# EAGLE schematic Analog-Wall-Clock (EAGLE 6.6.0)
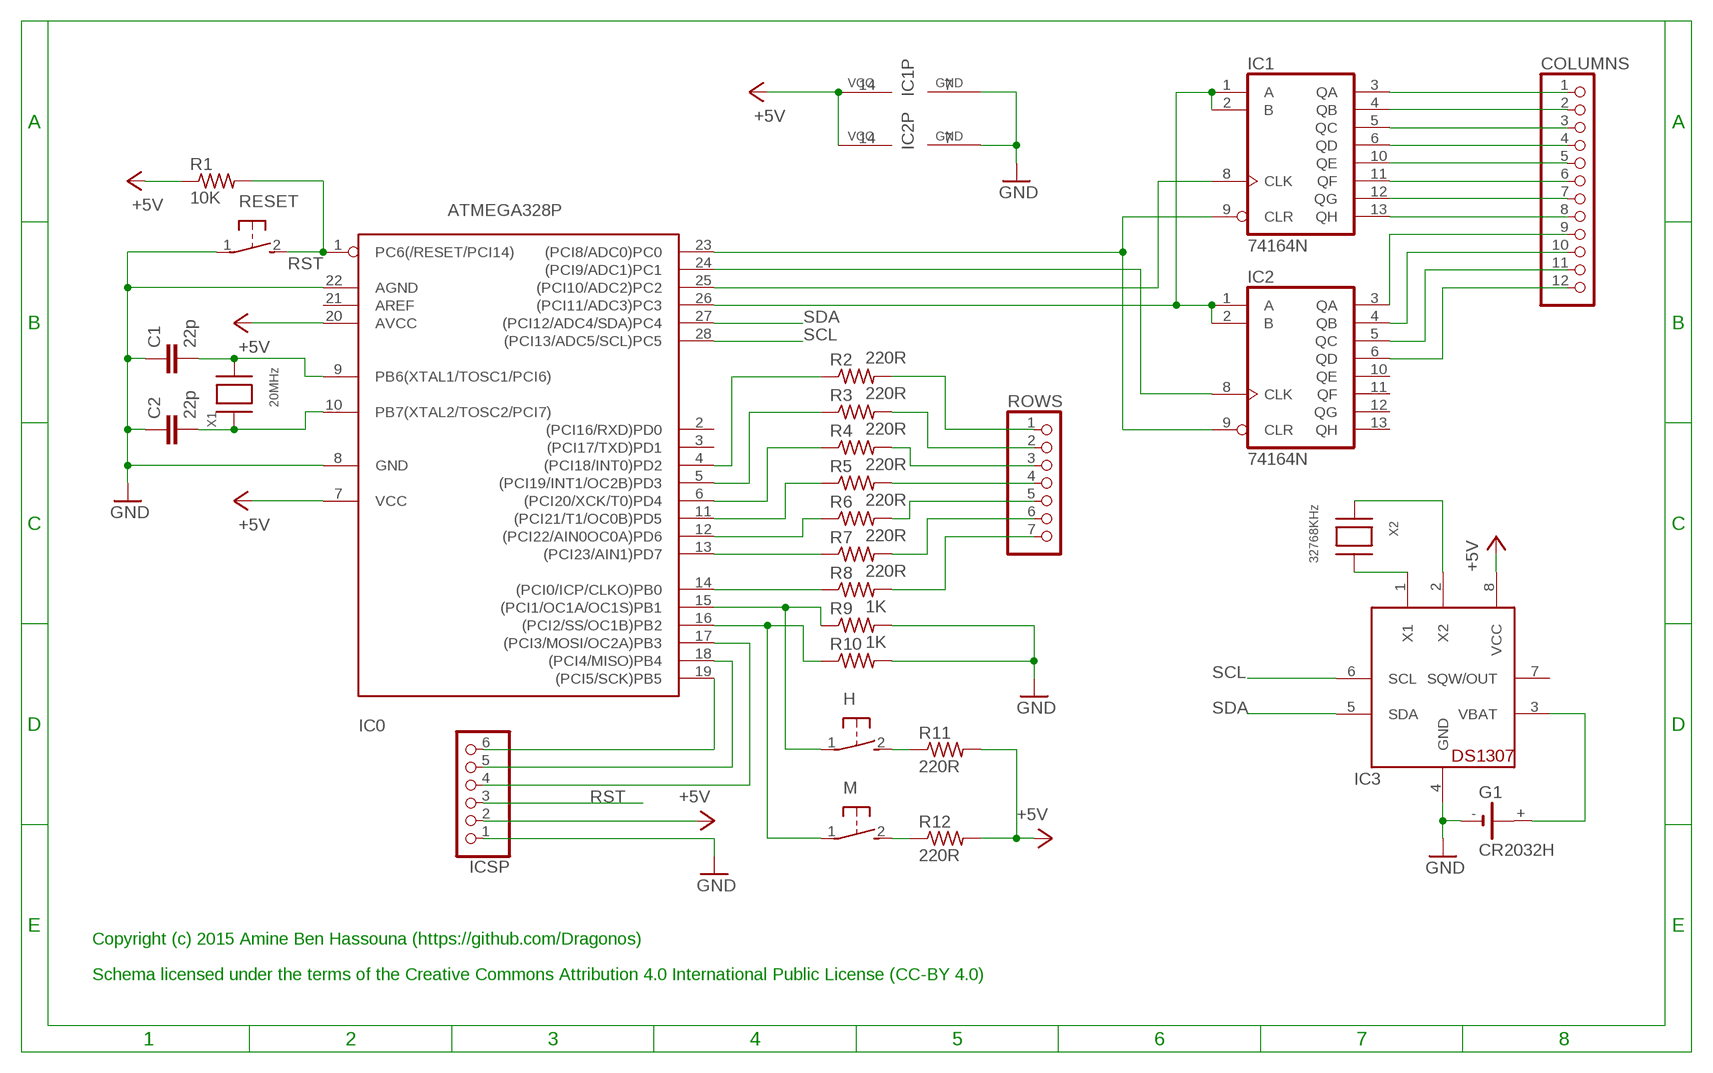
[diagram p0: schematic, sheet 1]

## Parts
C1  22p  C2,5-3  [C2.5-3]
C2  22p  C2,5-3  [C2.5-3]
COLUMNS  PINHD-1X12  [1X12]
G1  CR2032H  [CR2032H]
H  31-XX  [B3F-31XX]
IC0  ATMEGA328P  ATMEGA168-20P  [DIL28-3]
IC1  74164N  [DIL14]
IC2  74164N  [DIL14]
IC3  DS1307  [DIL08]
ICSP  PINHD-1X6  [1X06]
M  31-XX  [B3F-31XX]
R1  10K  R-US_0207/10  [0207/10]
R2  220R  R-US_0207/10  [0207/10]
R3  220R  R-US_0207/10  [0207/10]
R4  220R  R-US_0207/10  [0207/10]
R5  220R  R-US_0207/10  [0207/10]
R6  220R  R-US_0207/10  [0207/10]
R7  220R  R-US_0207/10  [0207/10]
R8  220R  R-US_0207/10  [0207/10]
R9  1K  R-US_0207/10  [0207/10]
R10  1K  R-US_0207/10  [0207/10]
R11  220R  R-US_0207/10  [0207/10]
R12  220R  R-US_0207/10  [0207/10]
RESET  31-XX  [B3F-31XX]
ROWS  PINHD-1X7  [1X07]
X1  20MHz  XTAL-3.2X1.5  [XTAL3215]
X2  32768KHz  XTAL-3.2X1.5  [XTAL3215]

## Nets
+5V: IC0.7(VCC) IC0.20(AVCC) IC1.14(VCC) IC2.14(VCC) IC3.8(VCC) ICSP.2 R1.1 R11.2 R12.2
GND: C1.1 C2.1 G1.- IC0.8(GND) IC0.22(AGND) IC1.7(GND) IC2.7(GND) IC3.4(GND) ICSP.1 R9.2 R10.2 RESET.1(P)
N$1: G1.+ IC3.3(VBAT)
N$2: C1.2 IC0.9(PB6(XTAL1/TOSC1/PCI6)) X1.P$1
N$3: C2.2 IC0.10(PB7(XTAL2/TOSC2/PCI7)) X1.P$2
N$4: IC0.4((PCI18/INT0)PD2) R2.1
N$5: IC0.5((PCI19/INT1/OC2B)PD3) R3.1
N$6: IC0.6((PCI20/XCK/T0)PD4) R4.1
N$7: IC0.11((PCI21/T1/OC0B)PD5) R5.1
N$8: IC0.12((PCI22/AIN0OC0A)PD6) R6.1
N$9: IC0.13((PCI23/AIN1)PD7) R7.1
N$10: IC0.14((PCI0/ICP/CLKO)PB0) R8.1
N$11: R5.2 ROWS.4
N$12: R6.2 ROWS.5
N$13: R7.2 ROWS.6
N$14: R8.2 ROWS.7
N$15: R4.2 ROWS.3
N$16: R3.2 ROWS.2
N$17: R2.2 ROWS.1
N$18: H.1(P) IC0.15((PCI1/OC1A/OC1S)PB1) R9.1
N$19: IC0.16((PCI2/SS/OC1B)PB2) M.1(P) R10.1
N$20: IC0.17((PCI3/MOSI/OC2A)PB3) ICSP.4
N$21: IC0.18((PCI4/MISO)PB4) ICSP.5
N$22: IC3.1(X1) X2.P$1
N$23: IC3.2(X2) X2.P$2
N$24: H.2(S) R11.1
N$25: M.2(S) R12.1
N$26: IC0.26((PCI11/ADC3)PC3) IC1.1(A) IC1.2(B) IC2.1(A) IC2.2(B)
N$27: IC0.25((PCI10/ADC2)PC2) IC1.8(CLK)
N$28: IC0.24((PCI9/ADC1)PC1) IC2.8(CLK)
N$30: COLUMNS.1 IC1.3(QA)
N$31: COLUMNS.2 IC1.4(QB)
N$32: COLUMNS.3 IC1.5(QC)
N$33: COLUMNS.4 IC1.6(QD)
N$34: COLUMNS.5 IC1.10(QE)
N$35: COLUMNS.6 IC1.11(QF)
N$36: COLUMNS.7 IC1.12(QG)
N$37: COLUMNS.8 IC1.13(QH)
N$38: COLUMNS.9 IC2.3(QA)
N$39: COLUMNS.10 IC2.4(QB)
N$40: COLUMNS.11 IC2.5(QC)
N$41: COLUMNS.12 IC2.6(QD)
N$42: IC0.23((PCI8/ADC0)PC0) IC1.9(CLR) IC2.9(CLR)
RST: IC0.1(PC6(/RESET/PCI14)) ICSP.3 R1.2 RESET.2(S)
SCK: IC0.19((PCI5/SCK)PB5) ICSP.6
SCL: IC0.28((PCI13/ADC5/SCL)PC5) IC3.6(SCL)
SDA: IC0.27((PCI12/ADC4/SDA)PC4) IC3.5(SDA)
Unconnected: G1.+@1(+) IC0.2((PCI16/RXD)PD0) IC0.3((PCI17/TXD)PD1) IC0.21(AREF) IC2.10(QE) IC2.11(QF) IC2.12(QG) IC2.13(QH) IC3.7(SQW/OUT)

## Notes on the sheet
- Copyright (c) 2015 Amine Ben Hassouna (https://github.com/Dragonos)
- Schema licensed under the terms of the Creative Commons Attribution 4.0 International Public License (CC-BY 4.0)

## Library data of the parts
C1 C2 = capacitor-wima:C: CAPACITOR naming: grid - package width
COLUMNS = pinhead:PINHD-1X12: PIN HEADER
G1 = battery:CR2032H: LI BATTERY Varta
H M RESET = switch-omron:31-XX: OMRON SWITCH; MPN: B3F-3100; OC_FARNELL: 959704; OC_NEWARK: 36M3582
IC0 = adafruit:ATMEGA168*P: MICROCONTROLLER 16 kBytes FLASH 1 kBytes SRAM 512 Bytes EEPROM USART 8-channel 10 bit ADC
IC1 IC2 = 74xx-us:74*164: 8-bit parallel out SHIFT REGISTER
IC3 = adafruit:DS1307: DS1307 Real time clock (RTC) with battery backup ability. Talk to it via i2c
ICSP = pinhead:PINHD-1X6: PIN HEADER
R1-R12 = adafruit:R-US_: RESISTOR, American symbol
ROWS = pinhead:PINHD-1X7: PIN HEADER
X1 X2 = adafruit:XTAL: Low cost SMT crystals, no capacitors included http://www.ladyada.net/library/eagle